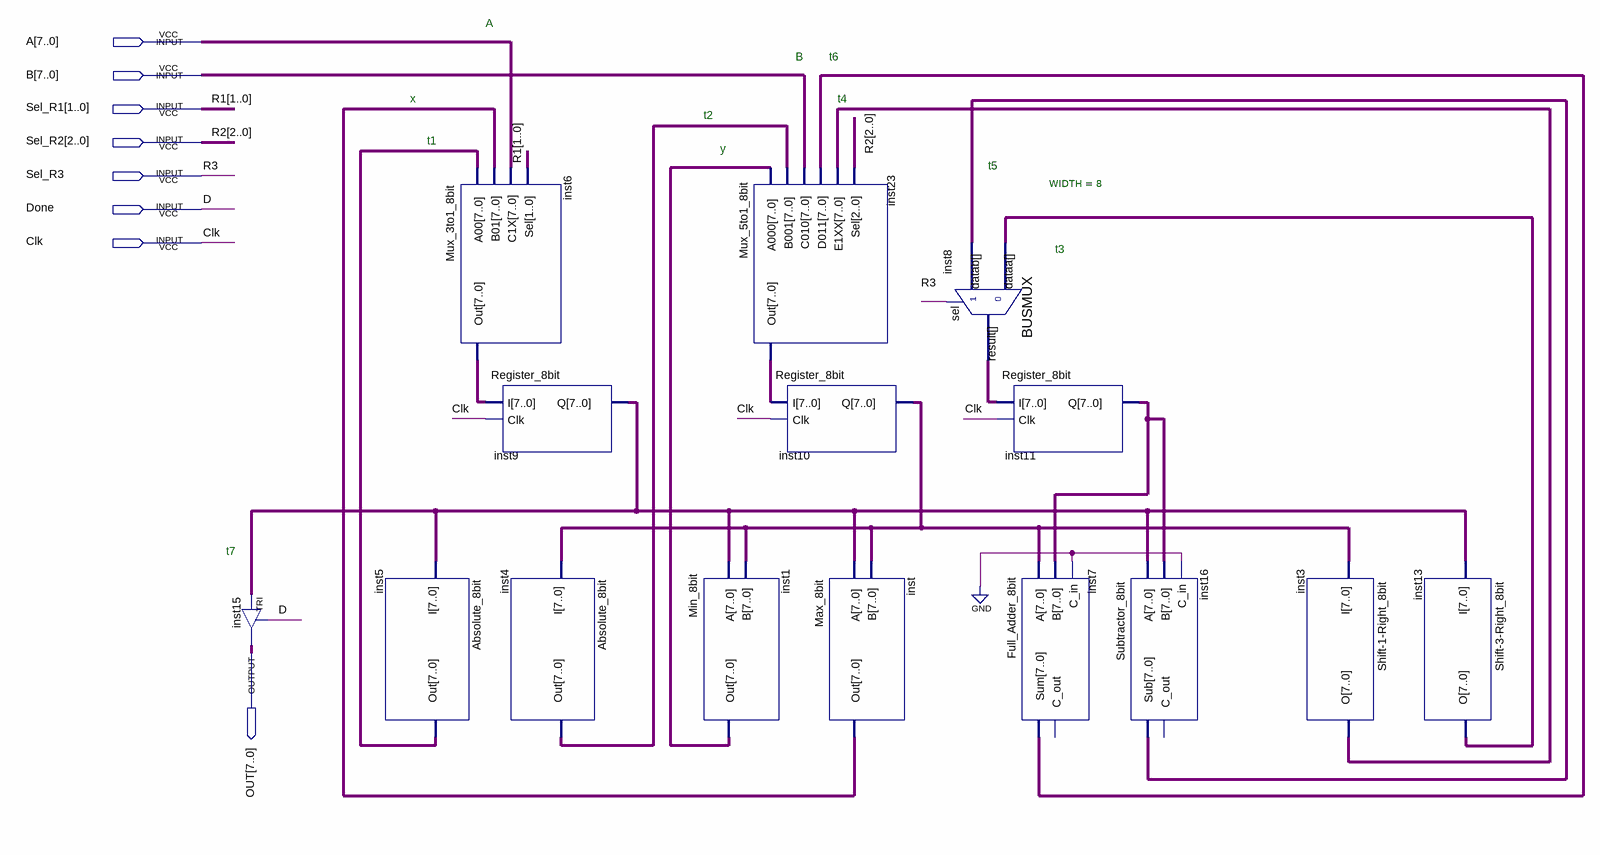
[diagram p0: schematic sheet]
// Quartus schematic Datapath.bdf as structural Verilog: 15 symbols, 8 pins
module Datapath (
  input  [7:0] A,
  input  [7:0] B,
  input  [1:0] Sel_R1,
  input  [2:0] Sel_R2,
  input  Sel_R3,
  input  Done,
  input  Clk,
  output [7:0] OUT
);

  wire [7:0] inst1_out, inst3_o, inst4_out, inst5_out, inst6_out, inst7_sum, inst8_result, inst9_q, inst10_q,
       inst11_q, inst13_o, inst16_sub, inst23_out, inst_out;

  TRI inst15[7:0] (.IN(inst9_q), .OE(Done), .OUT(OUT));
  Absolute_8bit inst5 (.I(inst9_q), .Out(inst5_out));
  Mux_3to1_8bit inst6 (.A00(inst5_out), .B01(inst_out), .C1X(A), .Sel(Sel_R1), .Out(inst6_out));
  Register_8bit inst9 (.I(inst6_out), .Clk(Clk), .Q(inst9_q));
  Absolute_8bit inst4 (.I(inst10_q), .Out(inst4_out));
  Min_8bit inst1 (.A(inst9_q), .B(inst10_q), .Out(inst1_out));
  Mux_5to1_8bit inst23 (
    .A000(inst1_out), .B001(inst4_out), .C010(B), .D011(inst7_sum), .E1XX(inst3_o), .Sel(Sel_R2),
    .Out(inst23_out));
  Register_8bit inst10 (.I(inst23_out), .Clk(Clk), .Q(inst10_q));
  Max_8bit inst (.A(inst9_q), .B(inst10_q), .Out(inst_out));
  BUSMUX #(.WIDTH(8)) inst8 (.datab(inst16_sub), .sel(Sel_R3), .dataa(inst13_o), .result(inst8_result));
  Register_8bit inst11 (.I(inst8_result), .Clk(Clk), .Q(inst11_q));
  Full_Adder_8bit inst7 (.A(inst10_q), .B(inst11_q), .C_in(1'b0), .Sum(inst7_sum));  // open: C_out
  Subtractor_8bit inst16 (.A(inst9_q), .B(inst11_q), .C_in(1'b0), .Sub(inst16_sub));  // open: C_out
  \Shift-1-Right_8bit  inst3 (.I(inst10_q), .O(inst3_o));
  \Shift-3-Right_8bit  inst13 (.I(inst9_q), .O(inst13_o));

  // Other names for the same wires on the sheet: D = Done; R1[1:0] = Sel_R1; R2[2:0] = Sel_R2; R3 = Sel_R3

  // Notes on the sheet:
  //   A
  //   B
  //   t6
  //   x
  //   t4
  //   t2
  //   t1
  //   y
  //   t5
  //   t3
  //   t7
endmodule
